# EAGLE design Display_EveryCook (EAGLE 6.4)
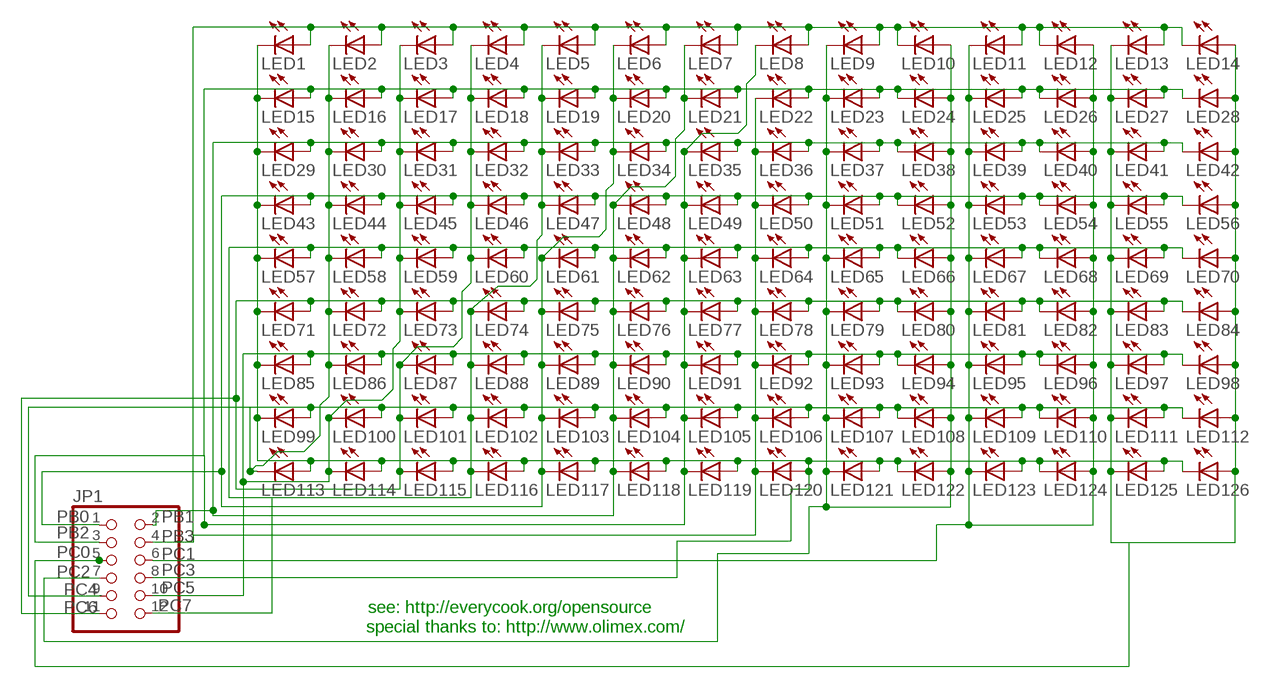
[diagram p0: schematic, sheet 1]

## Parts
JP1  PINHD-2X6  [2X06]
LED1  LEDKA-3528ASYC  [KA-3528ASYC]
LED2  LEDKA-3528ASYC  [KA-3528ASYC]
LED3  LEDKA-3528ASYC  [KA-3528ASYC]
LED4  LEDKA-3528ASYC  [KA-3528ASYC]
LED5  LEDKA-3528ASYC  [KA-3528ASYC]
LED6  LEDKA-3528ASYC  [KA-3528ASYC]
LED7  LEDKA-3528ASYC  [KA-3528ASYC]
LED8  LEDKA-3528ASYC  [KA-3528ASYC]
LED9  LEDKA-3528ASYC  [KA-3528ASYC]
LED10  LEDKA-3528ASYC  [KA-3528ASYC]
LED11  LEDKA-3528ASYC  [KA-3528ASYC]
LED12  LEDKA-3528ASYC  [KA-3528ASYC]
LED13  LEDKA-3528ASYC  [KA-3528ASYC]
LED14  LEDKA-3528ASYC  [KA-3528ASYC]
LED15  LEDKA-3528ASYC  [KA-3528ASYC]
LED16  LEDKA-3528ASYC  [KA-3528ASYC]
LED17  LEDKA-3528ASYC  [KA-3528ASYC]
LED18  LEDKA-3528ASYC  [KA-3528ASYC]
LED19  LEDKA-3528ASYC  [KA-3528ASYC]
LED20  LEDKA-3528ASYC  [KA-3528ASYC]
LED21  LEDKA-3528ASYC  [KA-3528ASYC]
LED22  LEDKA-3528ASYC  [KA-3528ASYC]
LED23  LEDKA-3528ASYC  [KA-3528ASYC]
LED24  LEDKA-3528ASYC  [KA-3528ASYC]
LED25  LEDKA-3528ASYC  [KA-3528ASYC]
LED26  LEDKA-3528ASYC  [KA-3528ASYC]
LED27  LEDKA-3528ASYC  [KA-3528ASYC]
LED28  LEDKA-3528ASYC  [KA-3528ASYC]
LED29  LEDKA-3528ASYC  [KA-3528ASYC]
LED30  LEDKA-3528ASYC  [KA-3528ASYC]
LED31  LEDKA-3528ASYC  [KA-3528ASYC]
LED32  LEDKA-3528ASYC  [KA-3528ASYC]
LED33  LEDKA-3528ASYC  [KA-3528ASYC]
LED34  LEDKA-3528ASYC  [KA-3528ASYC]
LED35  LEDKA-3528ASYC  [KA-3528ASYC]
LED36  LEDKA-3528ASYC  [KA-3528ASYC]
LED37  LEDKA-3528ASYC  [KA-3528ASYC]
LED38  LEDKA-3528ASYC  [KA-3528ASYC]
LED39  LEDKA-3528ASYC  [KA-3528ASYC]
LED40  LEDKA-3528ASYC  [KA-3528ASYC]
LED41  LEDKA-3528ASYC  [KA-3528ASYC]
LED42  LEDKA-3528ASYC  [KA-3528ASYC]
LED43  LEDKA-3528ASYC  [KA-3528ASYC]
LED44  LEDKA-3528ASYC  [KA-3528ASYC]
LED45  LEDKA-3528ASYC  [KA-3528ASYC]
LED46  LEDKA-3528ASYC  [KA-3528ASYC]
LED47  LEDKA-3528ASYC  [KA-3528ASYC]
LED48  LEDKA-3528ASYC  [KA-3528ASYC]
LED49  LEDKA-3528ASYC  [KA-3528ASYC]
LED50  LEDKA-3528ASYC  [KA-3528ASYC]
LED51  LEDKA-3528ASYC  [KA-3528ASYC]
LED52  LEDKA-3528ASYC  [KA-3528ASYC]
LED53  LEDKA-3528ASYC  [KA-3528ASYC]
LED54  LEDKA-3528ASYC  [KA-3528ASYC]
LED55  LEDKA-3528ASYC  [KA-3528ASYC]
LED56  LEDKA-3528ASYC  [KA-3528ASYC]
LED57  LEDKA-3528ASYC  [KA-3528ASYC]
LED58  LEDKA-3528ASYC  [KA-3528ASYC]
LED59  LEDKA-3528ASYC  [KA-3528ASYC]
LED60  LEDKA-3528ASYC  [KA-3528ASYC]
LED61  LEDKA-3528ASYC  [KA-3528ASYC]
LED62  LEDKA-3528ASYC  [KA-3528ASYC]
LED63  LEDKA-3528ASYC  [KA-3528ASYC]
LED64  LEDKA-3528ASYC  [KA-3528ASYC]
LED65  LEDKA-3528ASYC  [KA-3528ASYC]
LED66  LEDKA-3528ASYC  [KA-3528ASYC]
LED67  LEDKA-3528ASYC  [KA-3528ASYC]
LED68  LEDKA-3528ASYC  [KA-3528ASYC]
LED69  LEDKA-3528ASYC  [KA-3528ASYC]
LED70  LEDKA-3528ASYC  [KA-3528ASYC]
LED71  LEDKA-3528ASYC  [KA-3528ASYC]
LED72  LEDKA-3528ASYC  [KA-3528ASYC]
LED73  LEDKA-3528ASYC  [KA-3528ASYC]
LED74  LEDKA-3528ASYC  [KA-3528ASYC]
LED75  LEDKA-3528ASYC  [KA-3528ASYC]
LED76  LEDKA-3528ASYC  [KA-3528ASYC]
LED77  LEDKA-3528ASYC  [KA-3528ASYC]
LED78  LEDKA-3528ASYC  [KA-3528ASYC]
LED79  LEDKA-3528ASYC  [KA-3528ASYC]
LED80  LEDKA-3528ASYC  [KA-3528ASYC]
LED81  LEDKA-3528ASYC  [KA-3528ASYC]
LED82  LEDKA-3528ASYC  [KA-3528ASYC]
LED83  LEDKA-3528ASYC  [KA-3528ASYC]
LED84  LEDKA-3528ASYC  [KA-3528ASYC]
LED85  LEDKA-3528ASYC  [KA-3528ASYC]
LED86  LEDKA-3528ASYC  [KA-3528ASYC]
LED87  LEDKA-3528ASYC  [KA-3528ASYC]
LED88  LEDKA-3528ASYC  [KA-3528ASYC]
LED89  LEDKA-3528ASYC  [KA-3528ASYC]
LED90  LEDKA-3528ASYC  [KA-3528ASYC]
LED91  LEDKA-3528ASYC  [KA-3528ASYC]
LED92  LEDKA-3528ASYC  [KA-3528ASYC]
LED93  LEDKA-3528ASYC  [KA-3528ASYC]
LED94  LEDKA-3528ASYC  [KA-3528ASYC]
LED95  LEDKA-3528ASYC  [KA-3528ASYC]
LED96  LEDKA-3528ASYC  [KA-3528ASYC]
LED97  LEDKA-3528ASYC  [KA-3528ASYC]
LED98  LEDKA-3528ASYC  [KA-3528ASYC]
LED99  LEDKA-3528ASYC  [KA-3528ASYC]
LED100  LEDKA-3528ASYC  [KA-3528ASYC]
LED101  LEDKA-3528ASYC  [KA-3528ASYC]
LED102  LEDKA-3528ASYC  [KA-3528ASYC]
LED103  LEDKA-3528ASYC  [KA-3528ASYC]
LED104  LEDKA-3528ASYC  [KA-3528ASYC]
LED105  LEDKA-3528ASYC  [KA-3528ASYC]
LED106  LEDKA-3528ASYC  [KA-3528ASYC]
LED107  LEDKA-3528ASYC  [KA-3528ASYC]
LED108  LEDKA-3528ASYC  [KA-3528ASYC]
LED109  LEDKA-3528ASYC  [KA-3528ASYC]
LED110  LEDKA-3528ASYC  [KA-3528ASYC]
LED111  LEDKA-3528ASYC  [KA-3528ASYC]
LED112  LEDKA-3528ASYC  [KA-3528ASYC]
LED113  LEDKA-3528ASYC  [KA-3528ASYC]
LED114  LEDKA-3528ASYC  [KA-3528ASYC]
LED115  LEDKA-3528ASYC  [KA-3528ASYC]
LED116  LEDKA-3528ASYC  [KA-3528ASYC]
LED117  LEDKA-3528ASYC  [KA-3528ASYC]
LED118  LEDKA-3528ASYC  [KA-3528ASYC]
LED119  LEDKA-3528ASYC  [KA-3528ASYC]
LED120  LEDKA-3528ASYC  [KA-3528ASYC]
LED121  LEDKA-3528ASYC  [KA-3528ASYC]
LED122  LEDKA-3528ASYC  [KA-3528ASYC]
LED123  LEDKA-3528ASYC  [KA-3528ASYC]
LED124  LEDKA-3528ASYC  [KA-3528ASYC]
LED125  LEDKA-3528ASYC  [KA-3528ASYC]
LED126  LEDKA-3528ASYC  [KA-3528ASYC]

## Nets
PB0: JP1.1 LED6.C LED20.C LED34.C LED43.A LED44.A LED45.A LED46.A LED47.A LED48.A LED49.A LED50.A LED51.A LED52.C LED53.A LED54.C LED55.A LED56.C LED61.C LED75.C LED89.C LED103.C LED117.C
PB1: JP1.2 LED7.C LED21.C LED29.A LED30.A LED31.A LED32.A LED33.A LED34.A LED35.A LED36.A LED37.A LED38.C LED39.A LED40.C LED41.A LED42.C LED48.C LED62.C LED76.C LED90.C LED104.C LED118.C
PB2: JP1.3 LED8.C LED15.A LED16.A LED17.A LED18.A LED19.A LED20.A LED21.A LED22.A LED23.A LED24.C LED25.A LED26.C LED27.A LED28.C LED35.C LED49.C LED63.C LED77.C LED91.C LED105.C LED119.C
PB3: JP1.4 LED1.A LED2.A LED3.A LED4.A LED5.A LED6.A LED7.A LED8.A LED9.A LED10.C LED11.A LED12.C LED13.A LED14.C LED22.C LED36.C LED50.C LED64.C LED78.C LED92.C LED106.C LED120.C
PC0: JP1.5 LED13.C LED14.A LED27.C LED28.A LED41.C LED42.A LED55.C LED56.A LED69.C LED70.A LED83.C LED84.A LED97.C LED98.A LED111.C LED112.A LED125.C LED126.A
PC1: JP1.6 LED11.C LED12.A LED25.C LED26.A LED39.C LED40.A LED53.C LED54.A LED67.C LED68.A LED81.C LED82.A LED95.C LED96.A LED109.C LED110.A LED123.C LED124.A
PC2: JP1.7 LED9.C LED10.A LED23.C LED24.A LED37.C LED38.A LED51.C LED52.A LED65.C LED66.A LED79.C LED80.A LED93.C LED94.A LED107.C LED108.A LED121.C LED122.A
PC3: JP1.8 LED1.C LED15.C LED29.C LED43.C LED57.C LED71.C LED85.C LED99.C LED113.A LED114.A LED115.A LED116.A LED117.A LED118.A LED119.A LED120.A LED121.A LED122.C LED123.A LED124.C LED125.A LED126.C
PC4: JP1.9 LED2.C LED16.C LED30.C LED44.C LED58.C LED72.C LED86.C LED99.A LED100.A LED101.A LED102.A LED103.A LED104.A LED105.A LED106.A LED107.A LED108.C LED109.A LED110.C LED111.A LED112.C LED113.C
PC5: JP1.10 LED3.C LED17.C LED31.C LED45.C LED59.C LED73.C LED85.A LED86.A LED87.A LED88.A LED89.A LED90.A LED91.A LED92.A LED93.A LED94.C LED95.A LED96.C LED97.A LED98.C LED100.C LED114.C
PC6: JP1.11 LED4.C LED18.C LED32.C LED46.C LED60.C LED71.A LED72.A LED73.A LED74.A LED75.A LED76.A LED77.A LED78.A LED79.A LED80.C LED81.A LED82.C LED83.A LED84.C LED87.C LED101.C LED115.C
PC7: JP1.12 LED5.C LED19.C LED33.C LED47.C LED57.A LED58.A LED59.A LED60.A LED61.A LED62.A LED63.A LED64.A LED65.A LED66.C LED67.A LED68.C LED69.A LED70.C LED74.C LED88.C LED102.C LED116.C

## Notes on the sheet
- see: http://everycook.org/opensource
- special thanks to: http://www.olimex.com/

## Library data of the parts
JP1 = pinhead:PINHD-2X6: PIN HEADER
LED1-LED126 = led:LED: LED OSRAM: - CHIPLED LG R971, LG N971, LY N971, LG Q971, LY Q971, LO R971, LY R971 LH N974, LH R974 LS Q976, LO Q976, LY Q976 LO Q996 - Hyper CHIPLED LW Q18S LB Q993, LB Q99A, LB R99A - SideLED LS A670, LO A670, LY A670, LG A670, LP A670 LB A673, LV A673, LT A673, LW A673 LH A674 LY A675 LS A676, LA A676, LO A676, LY A676, LW A676 LS A679, LY A679, LG A679 - Hyper Micro SIDELED® LS Y876, LA Y876, LO Y876, LY Y876 LT Y87S - SmartLED LW L88C, LW L88S LB L89C, LB L89S, LG L890 LS L89K, LO L89K, LY L89K LS L896, LA L896, LO L896, LY L896 - TOPLED LS T670, LO T670, LY T670, LG T670, LP T670 LSG T670, LSP T670, LSY T670, LOP T670, LYG T670 LG T671, LOG T671, LSG T671 LB T673, LV T673, LT T673, LW T673 LH T674 LS T676, LA T676, LO T676, LY T676, LB T676, LH T676, LSB T676, LW T676 LB T67C, LV T67C, LT T67C, LS T67K, LO T67K, LY T67K, LW E67C LS E67B, LA E67B, LO E67B, LY E67B, LB E67C, LV E67C, LT E67C LW T67C LS T679, LY T679, LG T679 LS T770, LO T770, LY T770, LG T770, LP T770 LB T773, LV T773, LT T773, LW T773 LH T774 LS E675, LA E675, LY E675, LS T675 LS T776, LA T776, LO T776, LY T776, LB T776 LHGB T686 LT T68C, LB T68C - Hyper Mini TOPLED® LB M676 - Mini TOPLED Santana® LG M470 LS M47K, LO M47K, LY M47K Source: http://www.osram.convergy.de LUXEON: - LUMILED® LXK2-PW12-R00, LXK2-PW12-S00, LXK2-PW14-U00, LXK2-PW14-V00 LXK2-PM12-R00, LXK2-PM12-S00, LXK2-PM14-U00 LXK2-PE12-Q00, LXK2-PE12-R00, LXK2-PE12-S00, LXK2-PE14-T00, LXK2-PE14-U00 LXK2-PB12-K00, LXK2-PB12-L00, LXK2-PB12-M00, LXK2-PB14-N00, LXK2-PB14-P00, LXK2-PB14-Q00 LXK2-PR12-L00, LXK2-PR12-M00, LXK2-PR14-Q00, LXK2-PR14-R00 LXK2-PD12-Q00, LXK2-PD12-R00, LXK2-PD12-S00 LXK2-PH12-R00, LXK2-PH12-S00 LXK2-PL12-P00, LXK2-PL12-Q00, LXK2-PL12-R00 Source: www.luxeon.com KINGBRIGHT: KA-3528ASYC Source: www.kingbright.com

## Board
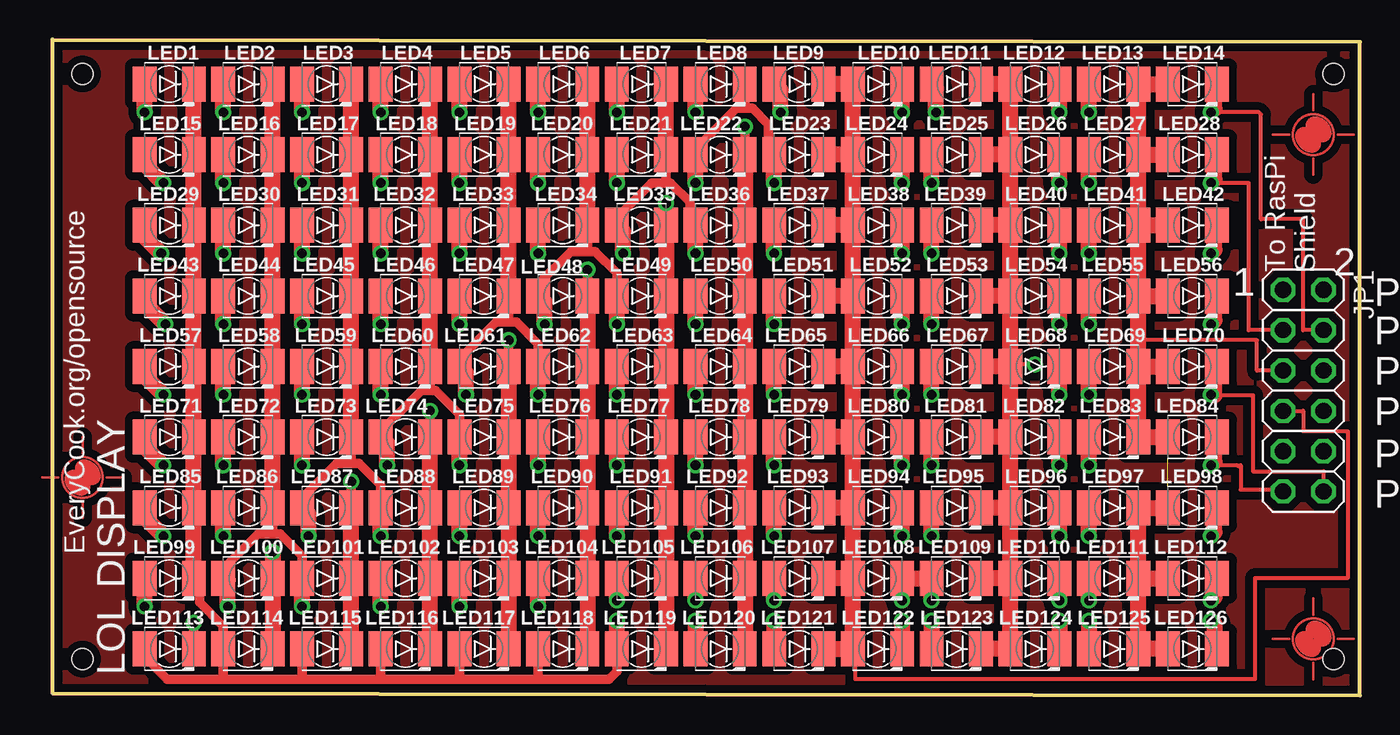
[diagram p1: board, top side]
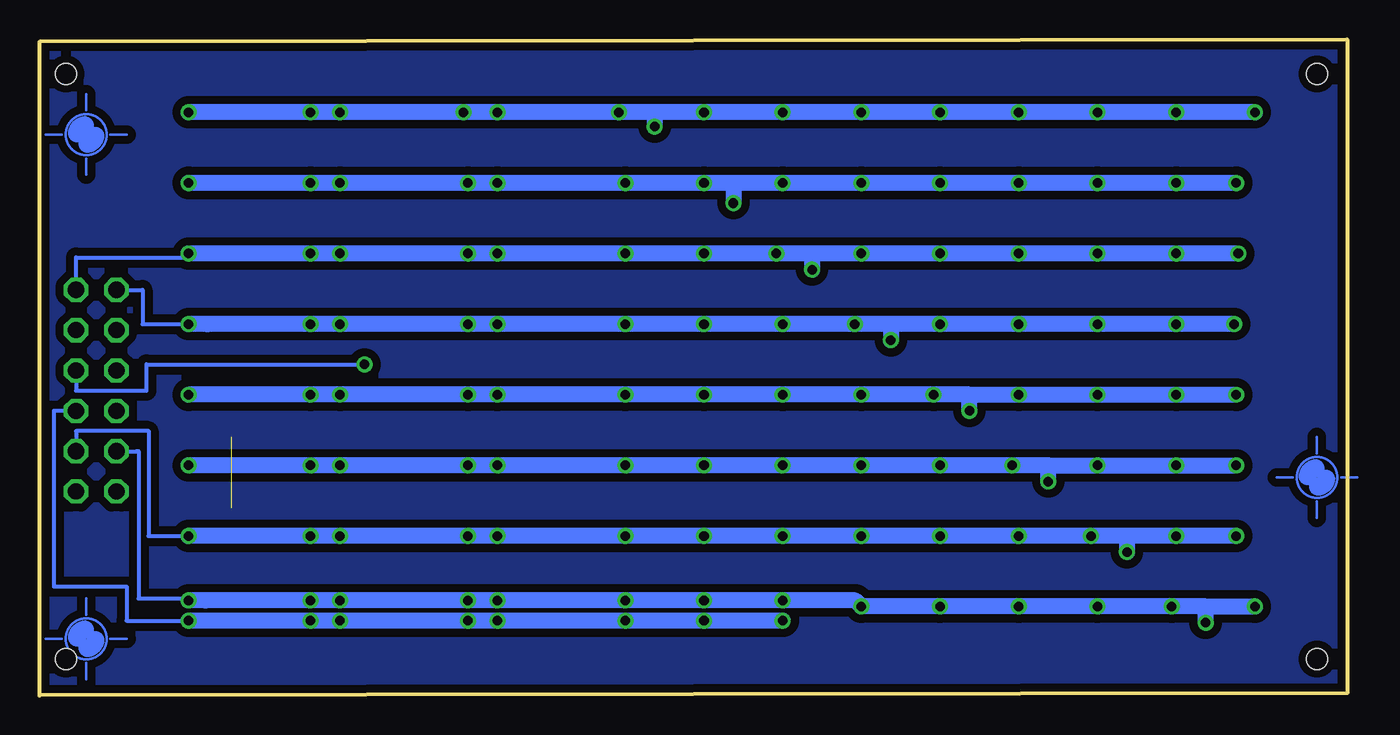
[diagram p2: board, bottom side, seen from below]

Size 82.3 x 41.28 mm. Coordinates in mm from the lower left corner, seen from the top.
Outline: 0,0.13 82.3,0 82.3,41.15 0,41.28 0,0.13
Copper layers (1+16): Top 0.035mm / dielectric 1.5mm / Bottom 0.035mm
Design rules "default *": minimum track width 10mil, minimum drill 19mil, track to track 10mil, track to pad 10mil, pad to pad 10mil, via to via 10mil, smd to smd 0mil, copper to edge 10mil, drill to drill 8mil, minimum pad ring 10mil, minimum via ring 8mil, stop-mask expansion 4mil, vias tented up to drill 32mil, thermal gap 10mil
Holes 1.3 mm at 1.91,39.12 1.91,2.29 80.65,39.12 80.65,2.29

### Footprints (pad centres in the part's own frame; a part is rotated, then mirrored left to right if it is on the bottom)
2X06 = drill 1.016 octagon: 1 -6.35,-1.27; 2 -6.35,1.27; 3 -3.81,-1.27; 4 -3.81,1.27; 5 -1.27,-1.27; 6 -1.27,1.27; 7 1.27,-1.27; 8 1.27,1.27; 9 3.81,-1.27; 10 3.81,1.27; 11 6.35,-1.27; 12 6.35,1.27
KA-3528ASYC = smd 1.5 x 2.2: A -1.55,0; C 1.55,0

### Placement (x,y rotation side)
JP1  78.74,19.18 270 top
LED1  7.37,38.48 0 top
LED2  12.32,38.48 0 top
LED3  17.27,38.48 0 top
LED4  22.23,38.48 0 top
LED5  27.18,38.48 0 top
LED6  32.13,38.48 0 top
LED7  37.08,38.48 0 top
LED8  42.04,38.48 0 top
LED9  46.99,38.48 0 top
LED10  51.94,38.48 0 top
LED11  56.9,38.48 0 top
LED12  61.85,38.48 0 top
LED13  66.8,38.48 0 top
LED14  71.75,38.48 0 top
LED15  7.37,34.04 0 top
LED16  12.32,34.04 0 top
LED17  17.27,34.04 0 top
LED18  22.23,34.04 0 top
LED19  27.18,34.04 0 top
LED20  32.13,34.04 0 top
LED21  37.08,34.04 0 top
LED22  42.04,34.04 0 top
LED23  46.99,34.04 0 top
LED24  51.94,34.04 0 top
LED25  56.9,34.04 0 top
LED26  61.85,34.04 0 top
LED27  66.8,34.04 0 top
LED28  71.75,34.04 0 top
LED29  7.37,29.59 0 top
LED30  12.32,29.59 0 top
LED31  17.27,29.59 0 top
LED32  22.23,29.59 0 top
LED33  27.18,29.59 0 top
LED34  32.13,29.59 0 top
LED35  37.08,29.59 0 top
LED36  42.04,29.59 0 top
LED37  46.99,29.59 0 top
LED38  51.94,29.59 0 top
LED39  56.9,29.59 0 top
LED40  61.85,29.59 0 top
LED41  66.8,29.59 0 top
LED42  71.75,29.59 0 top
LED43  7.37,25.15 0 top
LED44  12.32,25.15 0 top
LED45  17.27,25.15 0 top
LED46  22.23,25.15 0 top
LED47  27.18,25.15 0 top
LED48  32.13,25.15 0 top
LED49  37.08,25.15 0 top
LED50  42.04,25.15 0 top
LED51  46.99,25.15 0 top
LED52  51.94,25.15 0 top
LED53  56.9,25.15 0 top
LED54  61.85,25.15 0 top
LED55  66.8,25.15 0 top
LED56  71.75,25.15 0 top
LED57  7.37,20.7 0 top
LED58  12.32,20.7 0 top
LED59  17.27,20.7 0 top
LED60  22.23,20.7 0 top
LED61  27.18,20.7 0 top
LED62  32.13,20.7 0 top
LED63  37.08,20.7 0 top
LED64  42.04,20.7 0 top
LED65  46.99,20.7 0 top
LED66  51.94,20.7 0 top
LED67  56.9,20.7 0 top
LED68  61.85,20.7 0 top
LED69  66.8,20.7 0 top
LED70  71.75,20.7 0 top
LED71  7.37,16.26 0 top
LED72  12.32,16.26 0 top
LED73  17.27,16.26 0 top
LED74  22.23,16.26 0 top
LED75  27.18,16.26 0 top
LED76  32.13,16.26 0 top
LED77  37.08,16.26 0 top
LED78  42.04,16.26 0 top
LED79  46.99,16.26 0 top
LED80  51.94,16.26 0 top
LED81  56.9,16.26 0 top
LED82  61.85,16.26 0 top
LED83  66.8,16.26 0 top
LED84  71.75,16.26 0 top
LED85  7.37,11.81 0 top
LED86  12.32,11.81 0 top
LED87  17.27,11.81 0 top
LED88  22.23,11.81 0 top
LED89  27.18,11.81 0 top
LED90  32.13,11.81 0 top
LED91  37.08,11.81 0 top
LED92  42.04,11.81 0 top
LED93  46.99,11.81 0 top
LED94  51.94,11.81 0 top
LED95  56.9,11.81 0 top
LED96  61.85,11.81 0 top
LED97  66.8,11.81 0 top
LED98  71.75,11.81 0 top
LED99  7.37,7.37 0 top
LED100  12.32,7.37 0 top
LED101  17.27,7.37 0 top
LED102  22.23,7.37 0 top
LED103  27.18,7.37 0 top
LED104  32.13,7.37 0 top
LED105  37.08,7.37 0 top
LED106  42.04,7.37 0 top
LED107  46.99,7.37 0 top
LED108  51.94,7.37 0 top
LED109  56.9,7.37 0 top
LED110  61.85,7.37 0 top
LED111  66.8,7.37 0 top
LED112  71.75,7.37 0 top
LED113  7.37,2.92 0 top
LED114  12.32,2.92 0 top
LED115  17.27,2.92 0 top
LED116  22.23,2.92 0 top
LED117  27.18,2.92 0 top
LED118  32.13,2.92 0 top
LED119  37.08,2.92 0 top
LED120  42.04,2.92 0 top
LED121  46.99,2.92 0 top
LED122  51.94,2.92 0 top
LED123  56.9,2.92 0 top
LED124  61.85,2.92 0 top
LED125  66.8,2.92 0 top
LED126  71.75,2.92 0 top
U$1  [PASS-ROUND]  79.38,35.31 0 top
U$2  [PASS-ROUND]  1.91,13.72 0 top
U$3  [PASS-ROUND]  79.38,3.56 0 top

### Tracks (layer width: path | path; a pad name or v marks a point on that pad's centre or on a via)
BOTTOMFILL
  pour Bottom (isolate 0.508): 0,41.15 82.3,41.02 82.3,0 0,0.13
PB0  (via drill 0.6)
  Top 0.61: 33.68,27.94 34.16,27.94 35.53,26.57 LED49.A | 33.68,27.94 LED34.C | LED48.A 30.58,25.88 32.64,27.94 33.68,27.94 | v28.73,22.35 LED61.C
  Top 1.016: LED61.C LED75.C LED89.C LED103.C LED117.C | LED6.C LED20.C LED34.C | v7.11,23.37 5.82,24.66 LED43.A | v72.92,23.37 73.15,23.6 73.15,24.99 LED56.C | v30.99,23.37 30.99,24.74 LED48.A | v25.63,23.37 LED47.A | v20.68,23.37 LED46.A | v15.72,23.37 LED45.A | v10.77,23.37 LED44.A | v63.4,23.37 LED54.C | v53.49,23.37 LED52.C | v40.49,23.37 LED50.A | v35.53,23.37 LED49.A | v45.44,23.37 LED51.A | v55.35,23.37 LED53.A | v65.25,23.37 LED55.A
  Bottom 0.254: JP1.1 75.82,25.53 75.82,23.37 71.75,23.37
  Bottom 1.016: v7.11,23.37 v10.77,23.37 v15.72,23.37 v20.68,23.37 v25.63,23.37 28.73,23.37 | 28.73,23.37 v30.99,23.37 v35.53,23.37 v40.49,23.37 v45.44,23.37 v53.49,23.37 v55.35,23.37 v63.4,23.37 v65.25,23.37 71.75,23.37 v72.92,23.37 | 28.73,23.37 v28.73,22.35
PB1  (via drill 0.6)
  Top 0.61: 38.63,32.26 LED21.C | LED36.A 40.13,29.95 40.13,31.04 38.91,32.26 38.63,32.26 | LED35.A 35.53,30.07 37.72,32.26 38.63,32.26 | v33.68,26.8 LED48.C
  Top 1.016: LED21.C LED7.C | LED48.C LED62.C LED76.C LED90.C LED104.C LED118.C | v72.92,27.81 73.15,28.04 73.15,29.44 LED42.C | LED29.A 5.82,28.86 v6.86,27.81 | v35.94,27.81 35.94,29.18 LED35.A | v40.49,27.81 LED36.A | v45.44,27.81 LED37.A | v53.49,27.81 LED38.C | v55.35,27.81 LED39.A | v63.4,27.81 LED40.C | v65.25,27.81 LED41.A | v10.77,27.81 LED30.A | v15.72,27.81 LED31.A | v20.68,27.81 LED32.A | v30.58,27.81 LED34.A | v25.63,27.81 LED33.A
  Bottom 0.254: v72.92,27.81 72.92,27.56 80.01,27.56 JP1.2
  Bottom 1.016: v6.86,27.81 v10.77,27.81 v15.72,27.81 v20.68,27.81 v25.63,27.81 v30.58,27.81 33.68,27.81 | 33.68,27.81 v35.94,27.81 v40.49,27.81 v45.44,27.81 v53.49,27.81 v55.35,27.81 v63.4,27.81 v65.25,27.81 v72.92,27.81 | 33.68,27.81 v33.68,26.8
PB2  (via drill 0.6)
  Top 0.254: JP1.3 75.31,22.99 75.31,32.26 v72.92,32.26
  Top 0.406: LED22.A 40.49,34.39
  Top 0.61: v38.63,30.99 LED35.C | 40.49,34.39 43.05,36.96 43.59,36.96 | 43.59,36.96 LED8.C | LED23.A 45.09,34.39 45.09,35.94 44.07,36.96 43.59,36.96
  Top 1.016: LED35.C LED49.C LED63.C LED77.C LED91.C LED105.C LED119.C | v35.53,32.26 LED21.A | LED15.A 5.82,33.43 v6.99,32.26 | v10.77,32.26 LED16.A | v15.72,32.26 LED17.A | v20.68,32.26 LED18.A | v25.63,32.26 LED19.A | v30.58,32.26 LED20.A | v40.49,32.26 LED22.A | v72.92,32.26 73.15,32.49 73.15,33.88 LED28.C | v45.44,32.26 LED23.A | v53.49,32.26 LED24.C | v55.35,32.26 LED25.A | v63.4,32.26 LED26.C | v65.25,32.26 LED27.A
  Bottom 0.254: 71.12,32.39 70.87,32.26 70.61,32.13
  Bottom 1.016: v6.99,32.26 v10.77,32.26 v15.72,32.26 v20.68,32.26 v25.63,32.26 v30.58,32.26 v35.53,32.26 38.63,32.26 | 38.63,32.26 v38.63,30.99 | 38.63,32.26 v40.49,32.26 v45.44,32.26 v53.49,32.26 v55.35,32.26 v63.4,32.26 v65.25,32.26 70.87,32.26 v72.92,32.26
PB3  (via drill 0.6)
  Top 0.254: v72.92,36.7 75.95,36.7 76.07,36.58 76.07,29.97 78.74,29.97 78.74,22.99 JP1.4
  Top 0.61: v43.59,35.81 LED22.C
  Top 1.016: LED22.C LED36.C LED50.C LED64.C LED78.C LED92.C LED106.C LED120.C | v5.82,36.7 LED1.A | v72.92,36.7 73.15,36.93 73.15,38.33 LED14.C | v45.85,36.7 45.85,38.07 LED9.A | v10.77,36.7 LED2.A | v15.72,36.7 LED3.A | v20.68,36.7 LED4.A | v53.49,36.7 LED10.C | v55.63,36.7 55.63,38.2 LED11.A | v63.4,36.7 LED12.C | v65.25,36.7 LED13.A | v40.49,36.7 LED8.A | v30.58,36.7 LED6.A | v35.53,36.7 LED7.A | v25.63,36.7 LED5.A
  Bottom 1.016: v5.82,36.7 v10.77,36.7 v15.72,36.7 v20.68,36.7 v25.63,36.7 v30.58,36.7 v35.53,36.7 v40.49,36.7 43.59,36.7 | 43.59,36.7 v45.85,36.7 v53.49,36.7 v55.63,36.7 v63.4,36.7 v65.25,36.7 v72.92,36.7 | 43.59,36.7 v43.59,35.81
PC0  (1 unrouted)
  Top 0.254: JP1.5 75.82,20.45 75.82,22.35 68.35,22.35 68.35,22.1
  Top 1.016: LED111.C LED112.A | LED98.A LED97.C LED111.C | LED84.A LED83.C LED69.C | LED69.C LED70.A | LED55.C LED56.A | LED41.C LED42.A | LED27.C LED28.A | LED126.A LED125.C LED111.C | LED69.C 68.35,22.1 LED55.C | LED55.C LED41.C | LED41.C LED27.C | LED14.A LED13.C LED27.C
PC1  (via drill 0.6)
  Top 0.254: LED26.A 60.45,34.04 60.45,22.35 | v61.85,20.83 60.83,20.83 60.83,20.7 LED68.A
  Top 1.016: LED11.C LED12.A LED26.A | LED26.A LED25.C | LED40.A LED39.C | LED54.A LED53.C | LED68.A LED67.C | LED82.A LED81.C | LED96.A LED95.C | LED110.A LED109.C | LED123.C LED124.A LED110.A | LED110.A LED96.A | LED96.A LED82.A | LED82.A LED68.A | LED68.A LED54.A | LED54.A LED40.A | LED40.A LED26.A
  Bottom 0.254: JP1.6 80.01,19.18 75.56,19.18 75.56,20.83 v61.85,20.83
PC2
  Top 0.254: JP1.7 78.74,17.91 78.74,16.64 81.53,16.64 81.53,7.37 75.69,7.37 75.69,1.02 50.55,1.02 50.55,2.92 LED122.A
  Top 1.016: LED121.C LED122.A LED108.A | LED108.A LED107.C | LED94.A LED93.C | LED80.A LED79.C | LED66.A LED65.C | LED52.A LED51.C | LED38.A LED37.C | LED24.A LED23.C | LED9.C LED10.A LED24.A | LED38.A LED24.A | LED52.A LED38.A | LED94.A LED80.A | LED80.A LED66.A | LED66.A LED52.A | LED108.A LED94.A
PC3  (via drill 0.6)
  Top 0.61: LED99.C 9.27,7.01 9.27,5.84 10.77,4.34 LED114.A 10.77,1.02 | LED113.A 5.82,2.44 7.24,1.02 10.77,1.02 | 15.72,1.02 LED115.A | 20.68,1.02 LED116.A | 25.63,1.02 LED117.A | 30.58,1.02 LED118.A | 10.77,1.02 15.72,1.02 | 15.72,1.02 20.68,1.02 | 20.68,1.02 25.63,1.02 | 25.63,1.02 30.58,1.02 | LED119.A 35.53,1.5 35.05,1.02 30.58,1.02
  Top 1.016: LED99.C LED85.C LED71.C LED57.C LED43.C LED29.C LED15.C LED1.C | v72.92,4.7 73.15,4.47 73.15,3.07 LED126.C | v45.44,4.7 LED121.A | v53.49,4.7 LED122.C | v63.4,4.7 LED124.C | LED119.A v35.53,4.7 | v40.49,4.7 LED120.A | v55.35,4.7 LED123.A | v65.25,4.7 LED125.A
  Bottom 0.254: 72.39,4.7 76.84,4.7 76.84,6.86 81.41,6.86 81.41,17.91 JP1.8
  Bottom 1.016: v72.92,4.7 72.39,4.7 v65.25,4.7 v63.4,4.7 v55.35,4.7 v53.49,4.7 v45.44,4.7 v40.49,4.7 v35.53,4.7
PC4  (via drill 0.6)
  Top 0.61: 13.87,10.16 LED86.C | LED101.A 15.72,8.79 14.35,10.16 13.87,10.16 | 13.87,10.16 12.95,10.16 10.77,7.97 | LED113.C v8.92,4.57
  Top 1.016: LED86.C LED72.C LED58.C LED44.C LED30.C LED16.C LED2.C | 10.77,7.97 LED100.A | v72.92,5.97 73.15,6.2 73.15,7.21 LED112.C | v5.82,5.59 LED99.A | v11.05,5.59 11.05,7.24 | v55.35,5.97 LED109.A LED108.C v53.49,5.97 | v45.44,5.97 LED107.A | v40.49,5.97 LED106.A | v35.53,5.97 LED105.A | v30.58,5.59 LED104.A | v25.63,5.59 LED103.A | v20.68,5.59 LED102.A | v15.72,5.59 LED101.A | v63.4,5.97 LED110.C | v65.25,5.97 LED111.A
  Bottom 0.254: 71.88,5.97 71.88,6.1 76.07,6.1 76.07,15.37 76.2,15.37 JP1.9
  Bottom 1.016: 8.92,5.59 v5.82,5.59 | v8.92,4.57 8.92,5.59 | 8.92,5.59 v11.05,5.59 v15.72,5.59 v20.68,5.59 v25.63,5.59 v30.58,5.59 30.96,5.97 v35.53,5.97 v40.49,5.97 v45.44,5.97 v53.49,5.97 v55.35,5.97 v63.4,5.97 v65.25,5.97 71.88,5.97 v72.92,5.97
PC5  (via drill 0.6)
  Top 0.61: LED88.A 20.68,13.23 19.3,14.61 18.82,14.61 | 18.82,14.61 LED73.C | LED87.A 15.72,12.42 17.91,14.61 18.82,14.61
  Top 1.016: LED3.C LED17.C LED31.C LED45.C LED59.C LED73.C | v72.92,10.03 73.15,10.26 73.15,11.66 LED98.C | LED85.A 5.82,11.2 v6.99,10.03 | v16.13,10.03 16.13,11.4 LED87.A | v10.77,10.03 LED86.A | v13.87,9.02 LED100.C LED114.C | v55.35,10.03 LED95.A | v65.25,10.03 LED97.A | v25.63,10.03 LED89.A | v30.58,10.03 LED90.A | v35.53,10.03 LED91.A | v40.49,10.03 LED92.A | v45.44,10.03 LED93.A | v20.68,10.03 LED88.A | v53.49,10.03 LED94.C | v63.4,10.03 LED96.C
  Bottom 0.254: v72.92,10.03 75.44,10.03 75.44,16.64 80.01,16.64 JP1.10
  Bottom 1.016: 13.87,10.03 v16.13,10.03 v20.68,10.03 v25.63,10.03 v30.58,10.03 v35.53,10.03 v40.49,10.03 v45.44,10.03 v53.49,10.03 v55.35,10.03 v63.4,10.03 v65.25,10.03 v72.92,10.03 | v6.99,10.03 v10.77,10.03 13.87,10.03 | 13.87,10.03 v13.87,9.02
PC6  (via drill 0.6)
  Top 0.254: 74.8,14.35 74.55,14.48 | 74.55,14.48 v72.92,14.48 | 74.55,14.48 74.8,14.48 74.8,14.35 | 74.8,14.35 74.8,12.95 77.47,12.95 JP1.11
  Top 0.406: LED74.A 20.68,16.61
  Top 0.61: 23.77,19.18 LED60.C | LED75.A 25.63,17.68 24.13,19.18 23.77,19.18 | 20.68,16.61 23.24,19.18 23.77,19.18 | LED87.C v18.82,13.46
  Top 1.016: LED60.C LED46.C LED32.C LED18.C LED4.C | LED115.C LED101.C LED87.C | v6.99,14.48 5.82,15.65 LED71.A | v72.92,14.48 73.15,14.71 73.15,16.1 LED84.C | v10.77,14.48 LED72.A | v21.08,14.48 21.08,15.85 LED74.A | v15.72,14.48 LED73.A | v30.58,14.48 LED76.A | v35.53,14.48 LED77.A | v40.49,14.48 LED78.A | v45.44,14.48 LED79.A | v53.49,14.48 LED80.C | v55.35,14.48 LED81.A | v63.4,14.48 LED82.C | v65.25,14.48 LED83.A | v25.63,14.48 LED75.A
  Bottom 1.016: v6.99,14.48 v10.77,14.48 v15.72,14.48 18.82,14.48 | 18.82,14.48 v21.08,14.48 v25.63,14.48 v30.58,14.48 v35.53,14.48 v40.49,14.48 v45.44,14.48 v53.49,14.48 v55.35,14.48 v63.4,14.48 v65.25,14.48 v72.92,14.48 | v18.82,13.46 18.82,14.48
PC7  (via drill 0.6)
  Top 0.254: 73.15,18.9 75.56,18.9 75.56,14.1 80.01,14.1 JP1.12
  Top 0.61: LED62.A 30.58,22.12 29.21,23.5 28.73,23.5 | 28.73,23.5 LED47.C | LED61.A 25.63,21.18 27.94,23.5 28.73,23.5 | LED74.C v23.77,17.91
  Top 1.016: LED47.C LED33.C LED19.C LED5.C | LED74.C LED88.C LED102.C LED116.C | v72.92,18.92 73.15,18.9 73.15,20.55 LED70.C | v6.99,18.92 5.82,20.09 LED57.A | v26.04,18.92 26.04,20.29 LED61.A | v20.68,18.92 LED60.A | v15.72,18.92 LED59.A | v10.77,18.92 LED58.A | v40.49,18.92 LED64.A | v45.44,18.92 LED65.A | v53.49,18.92 LED66.C | v65.25,18.92 LED69.A | v30.58,18.92 LED62.A | v55.35,18.92 LED67.A | v63.4,18.92 LED68.C | v35.53,18.92 LED63.A
  Bottom 1.016: 23.77,18.92 v26.04,18.92 v30.58,18.92 v35.53,18.92 v40.49,18.92 v45.44,18.92 v53.49,18.92 v55.35,18.92 v63.4,18.92 v65.25,18.92 v72.92,18.92 | v6.99,18.92 v10.77,18.92 v15.72,18.92 v20.68,18.92 23.77,18.92 | v23.77,17.91 23.77,18.92
TOPFILL
  pour Top (isolate 0.508): 0,41.15 82.3,41.02 82.3,0 0,0.13

### Text on the board
tPlace: To RasPi / Shield | 2 | 1 | PB0 | PB1 | PB2 | PB3 | PC0 | PC1 | PC2 | PC3 | PC4 | PC5 | PC6 | PC7 | EveryCook.org/opensource | LOL DISPLAY
tValues: - | +
bDocu: v1.5